# Altium project Dashboard.PrjPCB
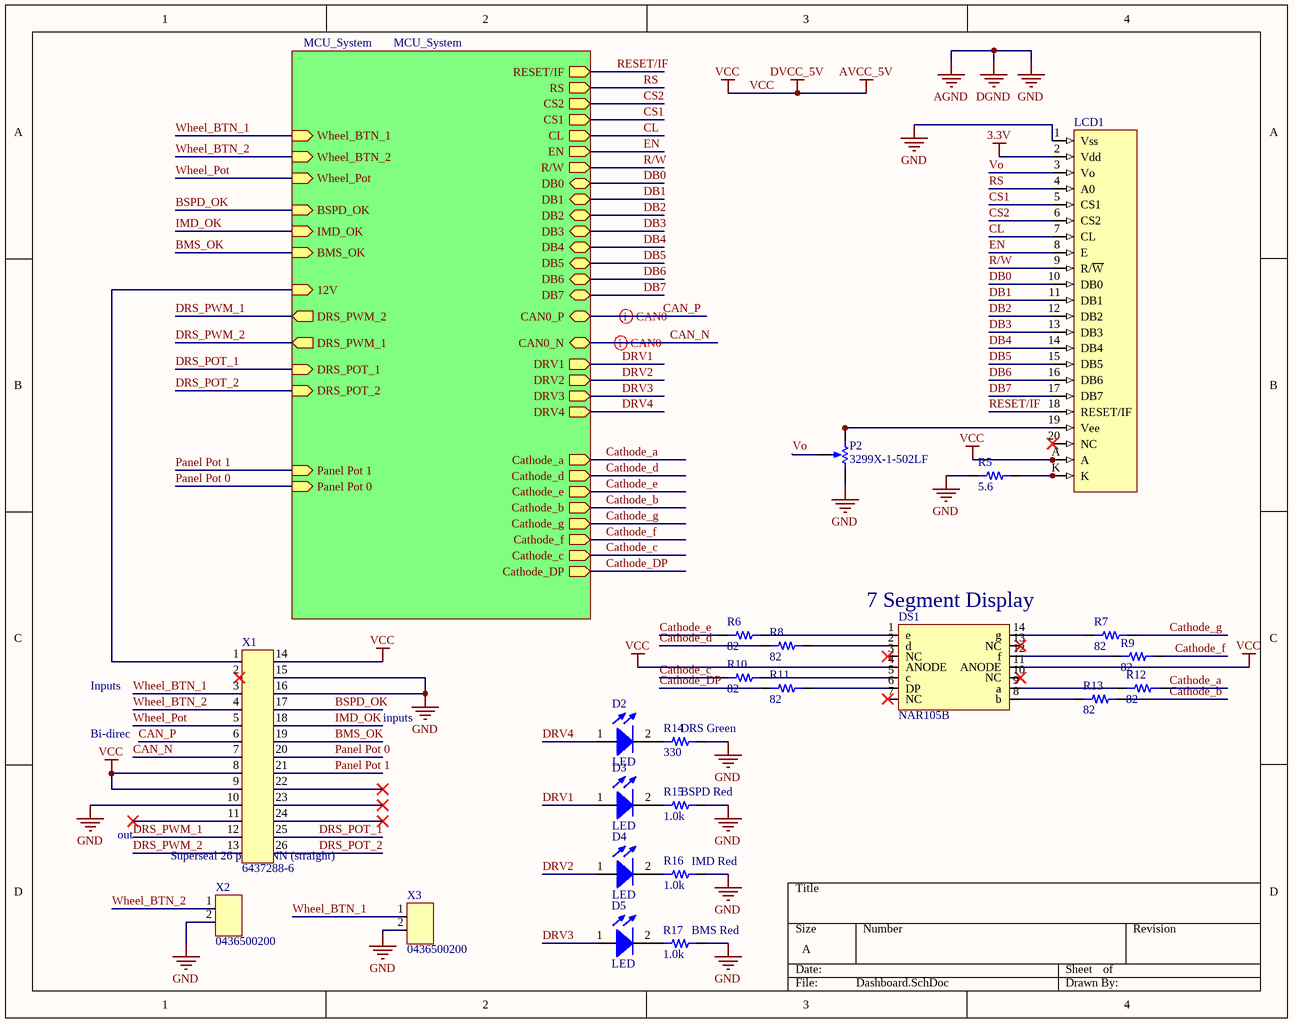
[diagram p0: Dashboard.SchDoc]
5 sheets, 60 parts. Net scope: hierarchical (ports join the sheet entries above them; power ports are global).
Board file: Dashboard.PcbDoc
Sheets:
  Dashboard.SchDoc
    MCU_System = MCU_System.SchDoc
      U_Power = Power.SchDoc
      U_High Side Drivers = High Side Drivers.SchDoc
      U_DRS_POT_LPFs = DRS_POT_LPFs.SchDoc

## Sheet Dashboard.SchDoc
size A

### Parts
D2  LED  [LED TH]
D3  LED  [LED TH]
D4  LED  [LED TH]
D5  LED  [LED TH]
DS1  NAR105B  [Stanley7Seg]
LCD1  (no value)  [NHD-12232]
P2  3299X-1-502LF  [3299X-1-502LF]
R5  value 5.6  [RES 0805/2012]  (hidden comment: Resistor 5.6 0805 1/2W 1%)
R6  value 82  [RES 0805/2012]  (hidden comment: Resistor 82 0805 1/4W 5%)
R7  value 82  [RES 0805/2012]  (hidden comment: Resistor 82 0805 1/4W 5%)
R8  value 82  [RES 0805/2012]  (hidden comment: Resistor 82 0805 1/4W 5%)
R9  value 82  [RES 0805/2012]  (hidden comment: Resistor 82 0805 1/4W 5%)
R10  value 82  [RES 0805/2012]  (hidden comment: Resistor 82 0805 1/4W 5%)
R11  value 82  [RES 0805/2012]  (hidden comment: Resistor 82 0805 1/4W 5%)
R12  value 82  [RES 0805/2012]  (hidden comment: Resistor 82 0805 1/4W 5%)
R13  value 82  [RES 0805/2012]  (hidden comment: Resistor 82 0805 1/4W 5%)
R14  value 330  [RES 0805/2012]  (hidden comment: Resistor 330 0805 1/4W 5%)
R15  value 1.0k  [RES 0805/2012]  (hidden comment: Resistor 1.0k 0805 1/4W 5%)
R16  value 1.0k  [RES 0805/2012]  (hidden comment: Resistor 1.0k 0805 1/4W 5%)
R17  value 1.0k  [RES 0805/2012]  (hidden comment: Resistor 1.0k 0805 1/4W 5%)
X1  6437288-6  [TE_Amp_6437288-6]
X2  0436500200  [CONN 43650-0200 MOLEX 2PIN]
X3  0436500200  [CONN 43650-0200 MOLEX 2PIN]

### Sub-sheets
MCU_System = MCU_System: Wheel_BTN_2 (in), Wheel_BTN_1 (in), Wheel_Pot (in), CAN0_N (bidir), CAN0_P (bidir), 12V (in), DRS_PWM_2 (out), DRS_PWM_1 (out), BMS_OK (in), IMD_OK (in), BSPD_OK (in), EN (out), R/W (out), CS2 (out), CS1 (out), RS (out), RESET/IF (out), CL (out), DRV2 (out), DRV3 (out), DRV1 (out), DRS_POT_1 (in), DRS_POT_2 (in), DB7 (bidir), DB3 (bidir), DB4 (bidir), DB5 (bidir), DB6 (bidir), DB1 (bidir), DB2 (bidir), DB0 (bidir), DRV4 (out), Cathode_a (out), Cathode_d (out), Cathode_e (out), Cathode_b (out), Cathode_g (out), Cathode_f (out), Cathode_c (out), Cathode_DP (out), Panel Pot 1 (in), Panel Pot 0 (in)

### Nets
3.3V: LCD1.2(Vdd)
AGND: LCD1.1(Vss) P2.3(BOT) R5.1 R14.2 R15.2 R16.2 R17.2 X1.10 X1.15 X1.16 X2.2 X3.2  [also labelled DGND, GND]
VCC: DS1.4(ANODE) DS1.11(ANODE) LCD1.A LCD1.A2(A) X1.8 X1.9 X1.14  [also labelled AVCC_5V, DVCC_5V]
BMS_OK: X1.19 ; sheet MCU_System/BMS_OK
BSPD_OK: X1.17 ; sheet MCU_System/BSPD_OK
CAN_N: X1.7 ; sheet MCU_System/CAN0_N
CAN_P: X1.6 ; sheet MCU_System/CAN0_P
Cathode_a: R12.2 ; sheet MCU_System/Cathode_a
Cathode_b: R13.2 ; sheet MCU_System/Cathode_b
Cathode_c: R10.1 ; sheet MCU_System/Cathode_c
Cathode_d: R8.1 ; sheet MCU_System/Cathode_d
Cathode_DP: R11.1 ; sheet MCU_System/Cathode_DP
Cathode_e: R6.1 ; sheet MCU_System/Cathode_e
Cathode_f: R9.2 ; sheet MCU_System/Cathode_f
Cathode_g: R7.2 ; sheet MCU_System/Cathode_g
CL: LCD1.7(CL) ; sheet MCU_System/CL
CS1: LCD1.5(CS1) ; sheet MCU_System/CS1
CS2: LCD1.6(CS2) ; sheet MCU_System/CS2
DB0: LCD1.10(DB0) ; sheet MCU_System/DB0
DB1: LCD1.11(DB1) ; sheet MCU_System/DB1
DB2: LCD1.12(DB2) ; sheet MCU_System/DB2
DB3: LCD1.13(DB3) ; sheet MCU_System/DB3
DB4: LCD1.14(DB4) ; sheet MCU_System/DB4
DB5: LCD1.15(DB5) ; sheet MCU_System/DB5
DB6: LCD1.16(DB6) ; sheet MCU_System/DB6
DB7: LCD1.17(DB7) ; sheet MCU_System/DB7
DRS_POT_1: X1.25 ; sheet MCU_System/DRS_POT_1
DRS_POT_2: X1.26 ; sheet MCU_System/DRS_POT_2
DRS_PWM_1: X1.12 ; sheet MCU_System/DRS_PWM_2
DRS_PWM_2: X1.13 ; sheet MCU_System/DRS_PWM_1
DRV1: D3.1(A) ; sheet MCU_System/DRV1
DRV2: D4.1(A) ; sheet MCU_System/DRV2
DRV3: D5.1(A) ; sheet MCU_System/DRV3
DRV4: D2.1(A) ; sheet MCU_System/DRV4
EN: LCD1.8(E) ; sheet MCU_System/EN
IMD_OK: X1.18 ; sheet MCU_System/IMD_OK
Panel Pot 0: X1.20 ; sheet MCU_System/Panel Pot 0
Panel Pot 1: X1.21 ; sheet MCU_System/Panel Pot 1
R/W: LCD1.9(R/~{W}) ; sheet MCU_System/R/W
RESET/IF: LCD1.18(RESET/IF) ; sheet MCU_System/RESET/IF
RS: LCD1.4(A0) ; sheet MCU_System/RS
Vo: LCD1.3(Vo) P2.2(TAP)
Wheel_BTN_1: X1.3 X3.1 ; sheet MCU_System/Wheel_BTN_1
Wheel_BTN_2: X1.4 X2.1 ; sheet MCU_System/Wheel_BTN_2
Wheel_Pot: X1.5 ; sheet MCU_System/Wheel_Pot
NetD2_2: D2.2(K) R14.1
NetD3_2: D3.2(K) R15.1
NetD4_2: D4.2(K) R16.1
NetD5_2: D5.2(K) R17.1
NetDS1_1: DS1.1(e) R6.2
NetDS1_2: DS1.2(d) R8.2
NetDS1_5: DS1.5(c) R10.2
NetDS1_6: DS1.6(DP) R11.2
NetDS1_8: DS1.8(b) R13.1
NetDS1_9: DS1.9(a) R12.1
NetDS1_12: DS1.12(f) R9.1
NetDS1_14: DS1.14(g) R7.1
NetLCD1_19: LCD1.19(Vee) P2.1(TOP)
NetLCD1_K: LCD1.K LCD1.K2(K) R5.2
NetX1_1: X1.1 ; sheet MCU_System/12V

Not connected (* = marked no-connect by the designer): DS1 3(NC)* 7(NC)* 10(NC)* 13(NC)*; LCD1 20(NC)*; X1 2* 11* 22* 23* 24*

### Layout directives
differential pair; rule Matched Net Lengths [Tolerance = 25.4mm]: CAN_N, CAN_P

### Notes on the sheet
- (near DS1) 7 Segment Display
- Inputs
- Bi-direc
- inputs
- (near R14) DRS Green
- out
- (near R15) BSPD Red
- (near X1) Superseal 26 pin CONN (straight)
- (near R16) IMD Red
- (near R17) BMS Red

### Library data of the parts
D2 = 4: LED GREEN DIFFUSED T/H; Manufacturer_id: 1; MfrPartNo: LTL-10233W; idLED: 4; Name: LED_TH_GREEN; Vf: 2.1V; Drawer_id: 1; Value: Green; Package: TH; Link: https://www.digikey.com/products/en?mpart=LTL-10233W&v=160
D3-D5 = 3: LED RED DIFFUSED T/H; Manufacturer_id: 1; MfrPartNo: LTL2R3KRD-EM; idLED: 3; Name: LED_TH_RED; Brightness: 50mcd; Id: 2mA; Vf: 1.8V; Drawer_id: 1; Value: Red; Package: TH; Link: https://www.digikey.com/products/en?mpart=LTL2R3KRD-EM&v=160
DS1 = 21: Character LED Display Module Red 7-Segment 1 Character Common Anode 3.4V 20mA 1.299" H x 0.898" W x 0.354" D (33.00mm x 22.80mm x 9.00mm) 14-DIP; Manufacturer_id: 7; idIC_Misc: 21; Drawer_id: 1; Name: 7_Seg_Disp; Type: 7 Segment; Protocol: Multiplexed; Vin(Max): 3.3V; MfrPartNo: NAR105B; Num_Circuits: 1; Package: DIP; Link: https://www.digikey.com/product-detail/en/stanley-electric-co/NAR105B/404-1126-ND/428836
LCD1 = 22: MfrPartNo: NHD-12232WG-EYYH-V#A-ND; Manufacturer_id: 10; idIC_Misc: 22; Drawer_id: 1; Name: NHD-12232 Display; Value: LCD Display; Vin(Min): 2.7V; Vin(Max): 3.3V; ComponentLink1Description: Datasheet; ComponentLink1URL: http://www.newhavendisplay.com/specs/NHD-12232WG-EYYH-VA.pdf
P2 = 6: Manufacturer_id: 1; idTable: 6; Value: 5K; Num_Contacts: 3; Pitch: 2.54mm; Drawer_id: 1; Name: 3299X-1-502LF; MfrPartNo: 3299X-1-502LF; Link: https://www.digikey.com/product-detail/en/bourns-inc/3299X-1-502LF/3299X-502LF-ND/1088167; ComponentLink1Description: Datasheet
R5 = 883: Manufacturer_id: 1; idResistor: 883; Name: Res_5.6_0805_1/2W_1%; Created_By: Nick Mah; Supplier 1: Digi-Key; Drawer_id: 1; Tolerance: 1%; Power: 1/2W; Package: 0805; ComponentLink1Description: Datasheet; Created_Date: 2018-10-20
R6-R13 = 1775: Manufacturer_id: 1; idResistor: 1775; Name: Res_82_0805_1/4W_5%; Created_By: Nick Mah; Supplier 1: Digi-Key; Drawer_id: 1; Tolerance: 5%; Power: 1/4W; Package: 0805; ComponentLink1Description: Datasheet; Created_Date: 2018-10-20
R14 = 1789: Manufacturer_id: 1; idResistor: 1789; Name: Res_330_0805_1/4W_5%; Created_By: Nick Mah; Supplier 1: Digi-Key; Drawer_id: 1; Tolerance: 5%; Power: 1/4W; Package: 0805; ComponentLink1Description: Datasheet; Created_Date: 2018-10-20
R15-R17 = 1801: Manufacturer_id: 1; idResistor: 1801; Name: Res_1.0k_0805_1/4W_5%; Created_By: Nick Mah; Supplier 1: Digi-Key; Drawer_id: 1; Tolerance: 5%; Power: 1/4W; Package: 0805; ComponentLink1Description: Datasheet; Created_Date: 2018-10-20
X1 = 7: Straight Angle 26Pos AMPSeal; Manufacturer_id: 5; idConn: 7; Drawer_id: 1; Name: AMP SuperSeal Straight; Value: CONN; Voltage_Rating: 250V; Num_Contacts: 26; Num_Rows: 4; Pitch: 3mm; Created_By: Nick; MfrPartNo: 6437288-6; Link: https://www.digikey.com/product-detail/en/te-connectivity-amp-connectors/6437288-6/A123256-ND/2329274; ComponentLink1Description: Drawing; ComponentLink1URL: https://www.te.com/commerce/DocumentDelivery/DDEController?Action=srchrtrv&DocNm=1437288-6&DocType=Customer+Drawing&DocLang=JP; Supplier1: Digi-Key; Supplier1PartNo: A123256-ND
X2 X3 = 9: Manufacturer_id: 4; idConn: 9; Drawer_id: 1; Name: Molex 43650_0200; Value: CONN; Num_Contacts: 2; Pitch: 3 mm; Created_By: Nick; MfrPartNo: 0436500200; Num_Rows: 1; Link: https://www.digikey.com/product-detail/en/molex-llc/0436500200/WM1860-ND/268989; ComponentLink1Description: Datasheet; ComponentLink1URL: https://www.molex.com/pdm_docs/sd/436500200_sd.pdf; Supplier1: Digi-Key; Supplier1PartNo: WM1860-ND

## Sheet MCU_System.SchDoc
size A
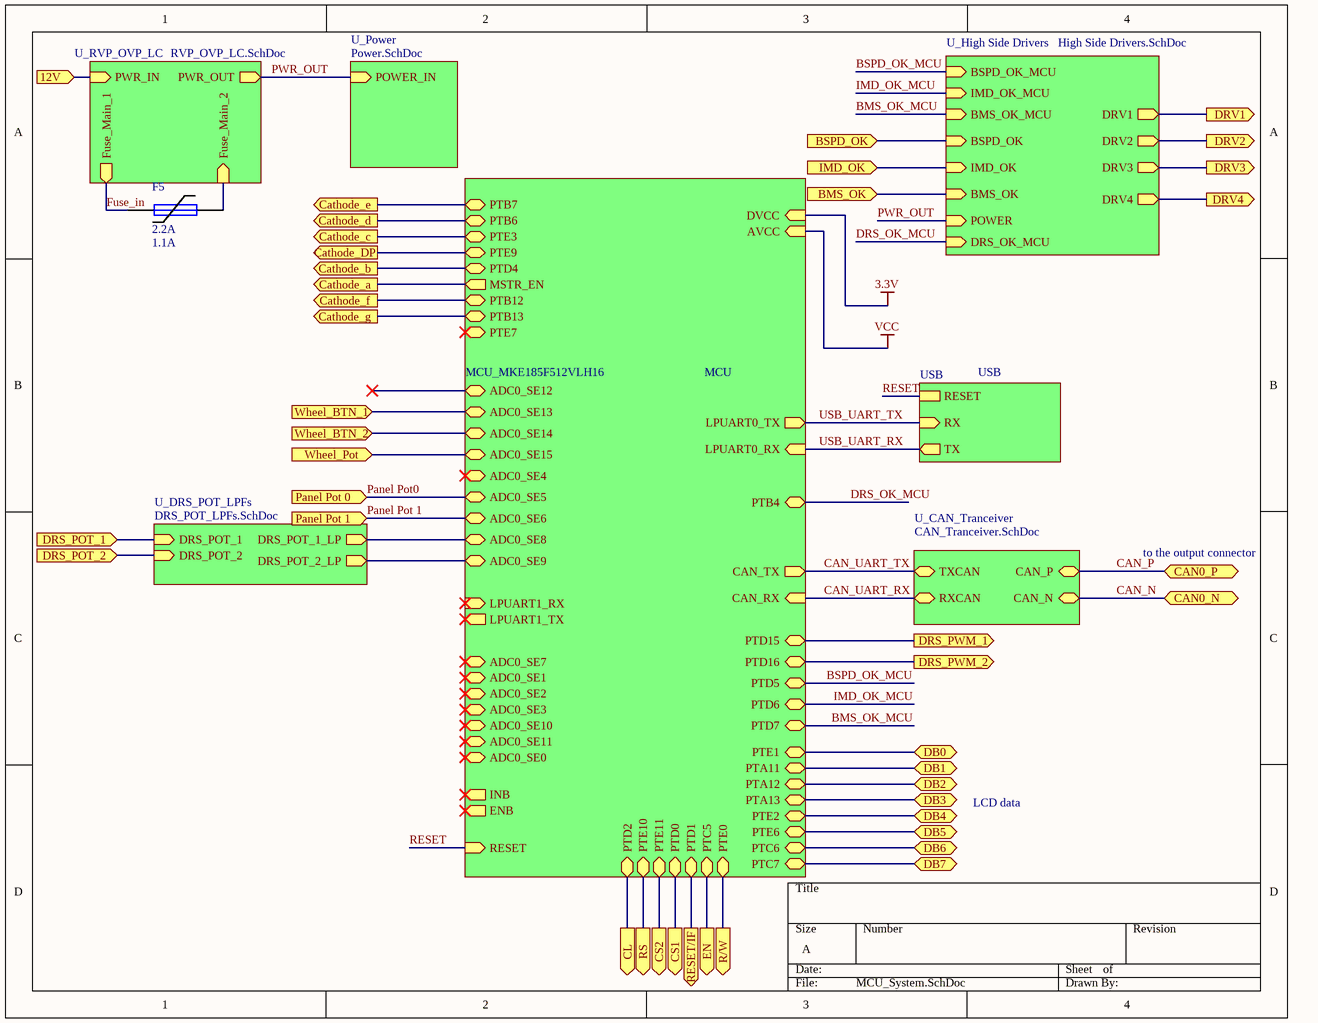
[diagram p1: MCU_System.SchDoc]

### Parts
F5  2.2A  I_hold: 1.1A  [PTC Fuse 1206/3216]

### Sub-sheets
MCU = MCU_MKE185F512VLH16 (file not in this document): LPUART1_RX (in), LPUART0_TX (out), LPUART0_RX (in), RESET (in), PTD6 (bidir), PTD7 (bidir), PTD5 (bidir), PTD15 (bidir), PTD16 (bidir), INB (out), ADC0_SE6 (bidir), ADC0_SE7 (bidir), ADC0_SE8 (bidir), ADC0_SE1 (bidir), ADC0_SE13 (bidir), ADC0_SE14 (bidir), ADC0_SE10 (bidir), ADC0_SE11 (bidir), ENB (out), ADC0_SE0 (bidir), ADC0_SE9 (bidir), ADC0_SE12 (bidir), ADC0_SE15 (bidir), PTB4 (bidir), AVCC (in), DVCC (in), ADC0_SE5 (bidir), MSTR_EN (out), ADC0_SE2 (bidir), ADC0_SE3 (bidir), ADC0_SE4 (bidir), PTE11 (bidir), PTE10 (bidir), PTB7 (bidir), PTB6 (bidir), PTE3 (bidir), PTE9 (bidir), PTE6 (bidir), PTC6 (bidir), PTC7 (bidir), PTD1 (bidir), PTD0 (bidir), PTA11 (bidir), PTA12 (bidir), PTA13 (bidir), PTD2 (bidir), PTE0 (bidir), PTE1 (bidir), PTE2 (bidir), PTB12 (bidir), PTB13 (bidir), PTD4 (bidir), PTC5 (bidir), PTE7 (bidir), LPUART1_TX (out), CAN_RX (in), CAN_TX (out)
U_CAN_Tranceiver = CAN_Tranceiver.SchDoc (file not in this document): TXCAN (bidir), RXCAN (bidir), CAN_N (bidir), CAN_P (bidir)
U_DRS_POT_LPFs = DRS_POT_LPFs.SchDoc: DRS_POT_1_LP (out), DRS_POT_1 (in), DRS_POT_2_LP (out), DRS_POT_2 (in)
U_High Side Drivers = High Side Drivers.SchDoc: BSPD_OK (in), IMD_OK (in), BMS_OK (in), DRV2 (out), DRV1 (out), DRV3 (out), BMS_OK_MCU (in), BSPD_OK_MCU (in), IMD_OK_MCU (in), POWER (in), DRS_OK_MCU (in), DRV4 (out)
U_Power = Power.SchDoc: POWER_IN (in)
U_RVP_OVP_LC = RVP_OVP_LC.SchDoc (file not in this document): PWR_IN (in), PWR_OUT (out), Fuse_Main_2 (in), Fuse_Main_1 (out)
USB = USB (file not in this document): TX (out), RX (in), RESET

### Ports
12V (in), BMS_OK (in), BSPD_OK (in), CAN0_N (bidir), CAN0_P (bidir), Cathode_a (out), Cathode_b (out), Cathode_c (out), Cathode_d (out), Cathode_DP (out), Cathode_e (out), Cathode_f (out), Cathode_g (out), CL (out), CS1 (out), CS2 (out), DB0 (bidir), DB1 (bidir), DB2 (bidir), DB3 (bidir), DB4 (bidir), DB5 (bidir), DB6 (bidir), DB7 (bidir), DRS_POT_1 (in), DRS_POT_2 (in), DRS_PWM_1 (out), DRS_PWM_2 (out), DRV1 (out), DRV2 (out), DRV3 (out), DRV4 (out), EN (out), IMD_OK (in), Panel Pot 0 (in), Panel Pot 1 (in), R/W (out), RESET/IF (out), RS (out), Wheel_BTN_1 (in), Wheel_BTN_2 (in), Wheel_Pot (in)

### Nets
BMS_OK: port BMS_OK, sheet U_High Side Drivers/BMS_OK
BMS_OK_MCU: sheet MCU/PTD7, sheet U_High Side Drivers/BMS_OK_MCU
BSPD_OK: port BSPD_OK, sheet U_High Side Drivers/BSPD_OK
BSPD_OK_MCU: sheet MCU/PTD5, sheet U_High Side Drivers/BSPD_OK_MCU
CAN_N: port CAN0_N, sheet U_CAN_Tranceiver/CAN_N
CAN_P: port CAN0_P, sheet U_CAN_Tranceiver/CAN_P
CAN_UART_RX: sheet MCU/CAN_RX, sheet U_CAN_Tranceiver/RXCAN
CAN_UART_TX: sheet MCU/CAN_TX, sheet U_CAN_Tranceiver/TXCAN
Cathode_a: port Cathode_a, sheet MCU/MSTR_EN
Cathode_b: port Cathode_b, sheet MCU/PTD4
Cathode_c: port Cathode_c, sheet MCU/PTE3
Cathode_d: port Cathode_d, sheet MCU/PTB6
Cathode_DP: port Cathode_DP, sheet MCU/PTE9
Cathode_e: port Cathode_e, sheet MCU/PTB7
Cathode_f: port Cathode_f, sheet MCU/PTB12
Cathode_g: port Cathode_g, sheet MCU/PTB13
CL: port CL, sheet MCU/PTD2
CS1: port CS1, sheet MCU/PTD0
CS2: port CS2, sheet MCU/PTE11
DB0: port DB0, sheet MCU/PTE1
DB1: port DB1, sheet MCU/PTA11
DB2: port DB2, sheet MCU/PTA12
DB3: port DB3, sheet MCU/PTA13
DB4: port DB4, sheet MCU/PTE2
DB5: port DB5, sheet MCU/PTE6
DB6: port DB6, sheet MCU/PTC6
DB7: port DB7, sheet MCU/PTC7
DRS_OK_MCU: sheet MCU/PTB4, sheet U_High Side Drivers/DRS_OK_MCU
DRS_POT_1: port DRS_POT_1, sheet U_DRS_POT_LPFs/DRS_POT_1
DRS_POT_2: port DRS_POT_2, sheet U_DRS_POT_LPFs/DRS_POT_2
DRS_PWM_1: port DRS_PWM_2, sheet MCU/PTD16
DRS_PWM_2: port DRS_PWM_1, sheet MCU/PTD15
DRV1: port DRV1, sheet U_High Side Drivers/DRV1
DRV2: port DRV2, sheet U_High Side Drivers/DRV2
DRV3: port DRV3, sheet U_High Side Drivers/DRV3
DRV4: port DRV4, sheet U_High Side Drivers/DRV4
EN: port EN, sheet MCU/PTC5
Fuse_in: F5.1 ; sheet U_RVP_OVP_LC/Fuse_Main_1
IMD_OK: port IMD_OK, sheet U_High Side Drivers/IMD_OK
IMD_OK_MCU: sheet MCU/PTD6, sheet U_High Side Drivers/IMD_OK_MCU
Panel Pot0: port Panel Pot 0, sheet MCU/ADC0_SE5  [project net Panel Pot 0]
Panel Pot 1: port Panel Pot 1, sheet MCU/ADC0_SE6
PWR_OUT: sheet U_RVP_OVP_LC/PWR_OUT, sheet U_Power/POWER_IN, sheet U_High Side Drivers/POWER  [project net 12V]
R/W: port R/W, sheet MCU/PTE0
RESET: sheet MCU/RESET, sheet USB/RESET
RESET/IF: port RESET/IF, sheet MCU/PTD1
RS: port RS, sheet MCU/PTE10
USB_UART_RX: sheet MCU/LPUART0_RX, sheet USB/TX
USB_UART_TX: sheet MCU/LPUART0_TX, sheet USB/RX
Wheel_BTN_1: port Wheel_BTN_1, sheet MCU/ADC0_SE13
Wheel_BTN_2: port Wheel_BTN_2, sheet MCU/ADC0_SE14
Wheel_Pot: port Wheel_Pot, sheet MCU/ADC0_SE15
NetC14_2: sheet MCU/ADC0_SE8, sheet U_DRS_POT_LPFs/DRS_POT_1_LP
NetC15_2: sheet MCU/ADC0_SE9, sheet U_DRS_POT_LPFs/DRS_POT_2_LP
NetF5_2: F5.2 ; sheet U_RVP_OVP_LC/Fuse_Main_2
NetX1_1: port 12V, sheet U_RVP_OVP_LC/PWR_IN

### Notes on the sheet
- to the output connector
- LCD data

### Library data of the parts
F5 = 8: Fuse; Manufacturer_id: 1; MfrPartNo: 1206L110/12SLYR; idFuse: 8; Name: Resettable; I_max: 50A; V_max: 12V; Pd_Typ: .8W; Published: 8-Jun-2000; LatestRevisionDate: 17-Jul-2002; LatestRevisionNote: Re-released for DXP Platform.; PackageReference: PIN-W2/E2.8; Publisher: Altium Limited; PackageDescription: Thru-Hole; 2 Leads; Drawer_id: 1; I_trip: 2.2A; Link: https://www.digikey.com/product-detail/en/littelfuse-inc/1206L110-12SLYR/F5764CT-ND/3593809

## Sheet Power.SchDoc
size A
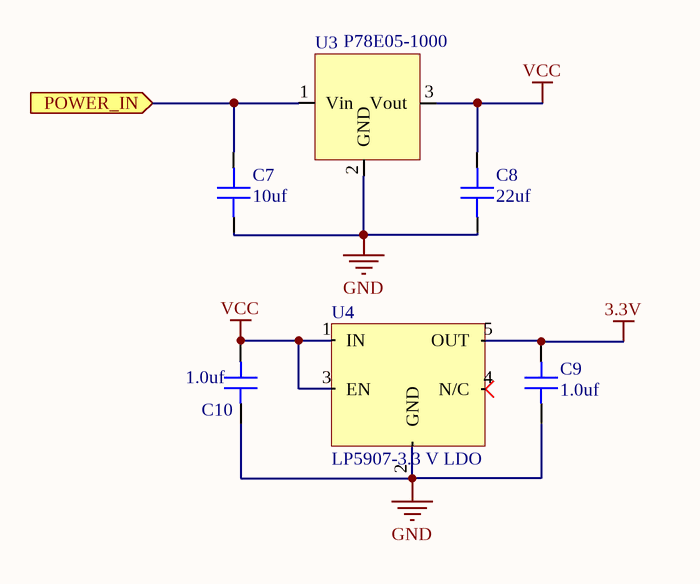
[diagram p2: Power.SchDoc]

### Parts
C7  value 10uf  [CAP 1206/3216 - 1.8MM]  (hidden comment: Capacitor MLCC 1.1pf 50V CAP 1206/3216)
C8  value 22uf  [CAP 0805/2012]  (hidden comment: Capacitor MLCC 22uf 16V CAP 0805/2012)
C9  value 1.0uf  [CAP 0603/1608]  (hidden comment: Capacitor MLCC 1.0uf 16V CAP 0603/1608)
C10  value 1.0uf  [CAP 0603/1608]  (hidden comment: Capacitor MLCC 1.0uf 16V CAP 0603/1608)
U3  P78E05-1000  [P78E05]
U4  LP5907-3.3 V LDO  [SOT23-5]

### Ports
POWER_IN (in)

### Nets
3.3V: C9.2 U4.5(OUT)
GND: C7.1 C8.1 C9.1 C10.1 U3.2(GND) U4.2(GND)  [project net AGND]
VCC: C8.2 C10.2 U3.3(Vout) U4.1(IN) U4.3(EN)
12V: C7.2 U3.1(Vin) ; port POWER_IN

Not connected (* = marked no-connect by the designer): U4 4(N/C)*

### Library data of the parts
C7 = 1081: Manufacturer_id: 1; idCapacitor: 1081; Name: Cap_10uf_50V_CAP 1206-3216; Dielectric: Ceramic; ESR: Null; Created_By: Nick Mah; Drawer_id: 1; Voltage_Rating: 50V; Package: CAP 2106/3216; ComponentLink1Description: Datasheet
C8 = 357: Manufacturer_id: 1; idCapacitor: 357; Name: Cap_22uf_16V_CAP 0805/2012; Dielectric: Ceramic; Created_By: Nick Mah; Drawer_id: 1; Voltage_Rating: 16V; Package: CAP 0805/2012; Created_Date: 10/20/2018
C9 C10 = 229: Manufacturer_id: 1; idCapacitor: 229; Name: Cap_1.0uf_16V_CAP 0603/1608; Dielectric: Ceramic; Created_By: Nick Mah; Drawer_id: 1; Voltage_Rating: 16V; Package: CAP 0603/1608; Created_Date: 10/20/2018
U3 = 1: Non-Isolated PoL Module DC DC Converter 1 Output 5V    1A 8V - 36V Input; Manufacturer_id: 11; idPMIC_SW: 1; Name: P78E05 5V Regulator; Value: Buck; Discrete: No; Power: 5W; Vout_Type: Fixed; Fs: 520kHz; Created_By: Nick; MfrPartNo: P78E05-1000; Drawer_id: 1; Num_Outputs: 1; Topology: Buck; Vin(Min): 8V; Vin(Max): 36V; Vout(Min): 5V; Vout(Max): 5V; Current_Rating: 1A; Package: 3-SIP; Link: https://www.digikey.com/product-detail/en/cui-inc/P78E05-1000/102-5018-ND/9649654; ComponentLink1Description: Datasheet; ComponentLink1URL: https://www.cui.com/product/resource/p78e-1000.pdf; Supplier1: Digi-Key; Supplier1PartNo: 102-5018-ND
U4 = 4: Manufacturer_id: 1; MfrPartNo: LP5907; idPMIC_Lin: 4; Name: LP5907 LDO; Value: 5.5V; Vin(Max): 6V; Drawer_id: 1; Package: SOT23-5

## Sheet High Side Drivers.SchDoc
size A
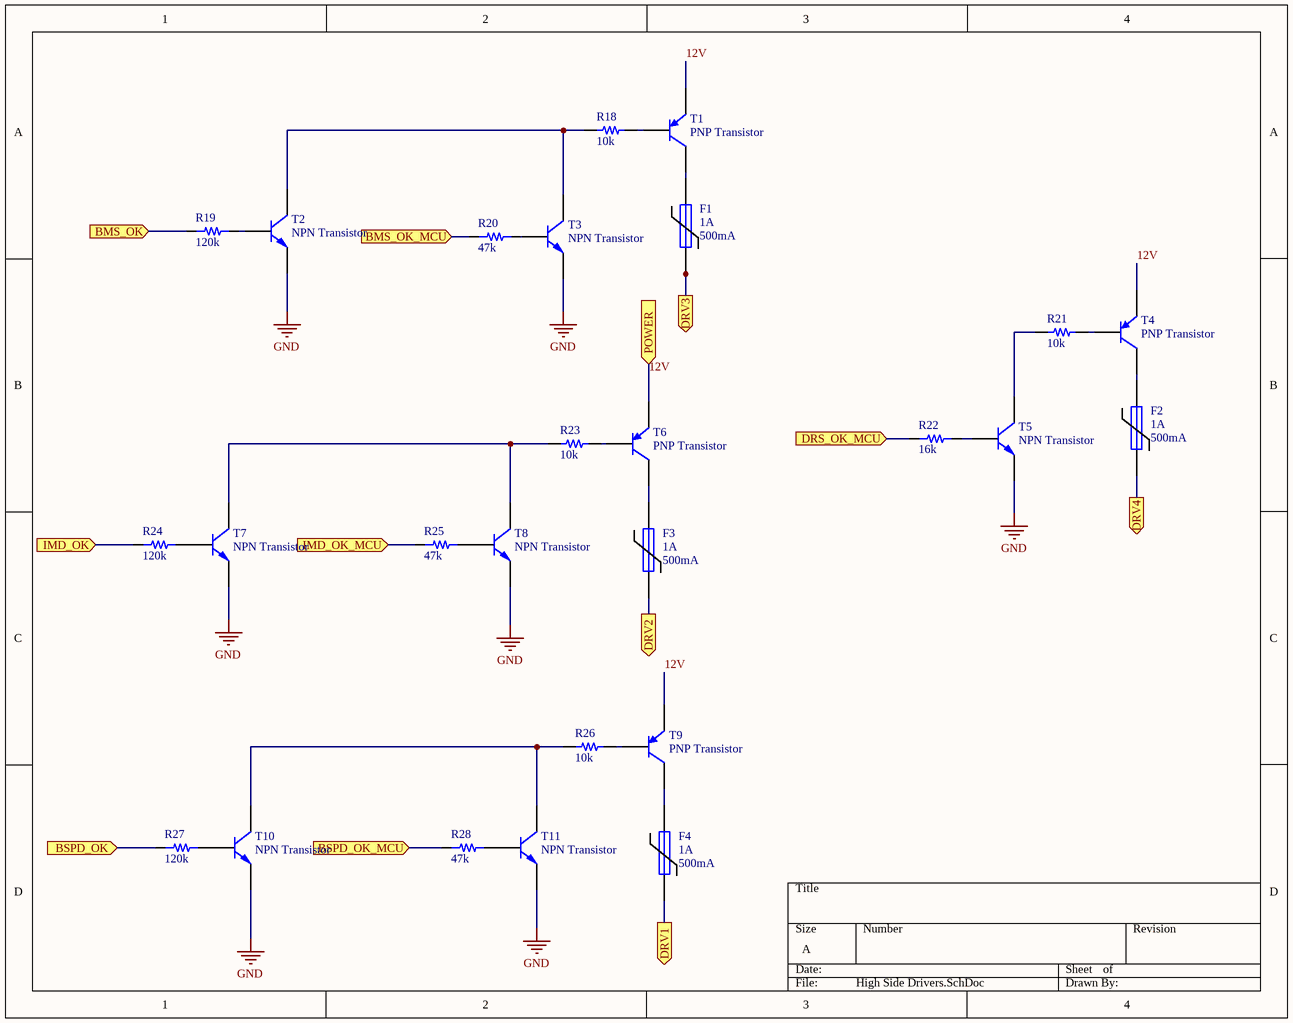
[diagram p3: High Side Drivers.SchDoc]

### Parts
F1  1A  I_hold: 500mA  [PTC Fuse 1206/3216]
F2  1A  I_hold: 500mA  [PTC Fuse 1206/3216]
F3  1A  I_hold: 500mA  [PTC Fuse 1206/3216]
F4  1A  I_hold: 500mA  [PTC Fuse 1206/3216]
R18  value 10k  [RES 0805/2012]  (hidden comment: Resistor 10k 0805 1/4W 5%)
R19  value 120k  [RES 0805/2012]  (hidden comment: Resistor 120k 0805 1/4W 1%)
R20  value 47k  [RES 0805/2012]  (hidden comment: Resistor 47k 0805 1/4W 1%)
R21  value 10k  [RES 0805/2012]  (hidden comment: Resistor 10k 0805 1/4W 5%)
R22  value 16k  [RES 0805/2012]  (hidden comment: Resistor 16k 0805 1/4W 1%)
R23  value 10k  [RES 0805/2012]  (hidden comment: Resistor 10k 0805 1/4W 5%)
R24  value 120k  [RES 0805/2012]  (hidden comment: Resistor 120k 0805 1/4W 1%)
R25  value 47k  [RES 0805/2012]  (hidden comment: Resistor 47k 0805 1/4W 1%)
R26  value 10k  [RES 0805/2012]  (hidden comment: Resistor 10k 0805 1/4W 5%)
R27  value 120k  [RES 0805/2012]  (hidden comment: Resistor 120k 0805 1/4W 1%)
R28  value 47k  [RES 0805/2012]  (hidden comment: Resistor 47k 0805 1/4W 1%)
T1  PNP Transistor  [SOT23-3]
T2  NPN Transistor  [SOT23-3]
T3  NPN Transistor  [SOT23-3]
T4  PNP Transistor  [SOT23-3]
T5  NPN Transistor  [SOT23-3]
T6  PNP Transistor  [SOT23-3]
T7  NPN Transistor  [SOT23-3]
T8  NPN Transistor  [SOT23-3]
T9  PNP Transistor  [SOT23-3]
T10  NPN Transistor  [SOT23-3]
T11  NPN Transistor  [SOT23-3]

### Ports
BMS_OK (in), BMS_OK_MCU (in), BSPD_OK (in), BSPD_OK_MCU (in), DRS_OK_MCU (in), DRV1 (out), DRV2 (out), DRV3 (out), DRV4 (out), IMD_OK (in), IMD_OK_MCU (in), POWER (in)

### Nets
GND: T2.1(E) T3.1(E) T5.1(E) T7.1(E) T8.1(E) T10.1(E) T11.1(E)  [project net AGND]
12V: T1.2(E) T4.2(E) T6.2(E) T9.2(E) ; port POWER
BMS_OK: R19.1 ; port BMS_OK
BMS_OK_MCU: R20.1 ; port BMS_OK_MCU
BSPD_OK: R27.1 ; port BSPD_OK
BSPD_OK_MCU: R28.1 ; port BSPD_OK_MCU
DRS_OK_MCU: R22.1 ; port DRS_OK_MCU
DRV1: F4.1 ; port DRV1
DRV2: F3.1 ; port DRV2
DRV3: F1.1 ; port DRV3
DRV4: F2.1 ; port DRV4
IMD_OK: R24.1 ; port IMD_OK
IMD_OK_MCU: R25.1 ; port IMD_OK_MCU
NetF1_2: F1.2 T1.3(C)
NetF2_2: F2.2 T4.3(C)
NetF3_2: F3.2 T6.3(C)
NetF4_2: F4.2 T9.3(C)
NetR18_1: R18.1 T2.3(C) T3.3(C)
NetR18_2: R18.2 T1.1(B)
NetR19_2: R19.2 T2.2(B)
NetR20_2: R20.2 T3.2(B)
NetR21_1: R21.1 T5.3(C)
NetR21_2: R21.2 T4.1(B)
NetR22_2: R22.2 T5.2(B)
NetR23_1: R23.1 T7.3(C) T8.3(C)
NetR23_2: R23.2 T6.1(B)
NetR24_2: R24.2 T7.2(B)
NetR25_2: R25.2 T8.2(B)
NetR26_1: R26.1 T10.3(C) T11.3(C)
NetR26_2: R26.2 T9.1(B)
NetR27_2: R27.2 T10.2(B)
NetR28_2: R28.2 T11.2(B)

### Library data of the parts
F1-F4 = 5: Fuse; Manufacturer_id: 1; MfrPartNo: 1206L050/15YR; idFuse: 5; Name: PTC Poly Fuse Resettable; I_max: 100A; V_max: 15V; Pd_Typ: 600mW; Created_By: Angel; Published: 8-Jun-2000; LatestRevisionDate: 17-Jul-2002; LatestRevisionNote: Re-released for DXP Platform.; PackageReference: PIN-W2/E2.8; Publisher: Altium Limited; PackageDescription: Thru-Hole; 2 Leads; Drawer_id: 1; I_trip: 1A; Link: https://www.digikey.com/product-detail/en/littelfuse-inc/1206L050-15YR/F3733CT-ND/2486168; Created_Date: 10/27/2018
R18 R21 R23 R26 = 1825: Manufacturer_id: 1; idResistor: 1825; Name: Res_10k_0805_1/4W_5%; Created_By: Nick Mah; Supplier 1: Digi-Key; Drawer_id: 1; Tolerance: 5%; Power: 1/4W; Package: 0805; ComponentLink1Description: Datasheet; Created_Date: 2018-10-20
R19 R24 R27 = 771: Manufacturer_id: 1; idResistor: 771; Name: Res_120k_0805_1/4W_1%; Created_By: Nick Mah; Supplier 1: Digi-Key; Drawer_id: 1; Tolerance: 1%; Power: 1/4W; Package: 0805; ComponentLink1Description: Datasheet; Created_Date: 2018-10-20
R20 R25 R28 = 761: Manufacturer_id: 1; idResistor: 761; Name: Res_47k_0805_1/4W_1%; Created_By: Nick Mah; Supplier 1: Digi-Key; Drawer_id: 1; Tolerance: 1%; Power: 1/4W; Package: 0805; ComponentLink1Description: Datasheet; Created_Date: 2018-10-20
R22 = 750: Manufacturer_id: 1; idResistor: 750; Name: Res_16k_0805_1/4W_1%; Created_By: Nick Mah; Supplier 1: Digi-Key; Drawer_id: 1; Tolerance: 1%; Power: 1/4W; Package: 0805; ComponentLink1Description: Datasheet; Created_Date: 2018-10-20
T1 T4 T6 T9 = 3: Manufacturer_id: 1; idBJT: 3; Name: MMBT4403WT1G; Ic: 600mA; Vce(Max): -40V; Created_By: Angel; Drawer_id: 1; Type: PNP; Num_Circuits: 1; Package: SOT23-3; MfrPartNo: MMBT4403WT1G; Link: https://www.digikey.com/product-detail/en/on-semiconductor/MMBT4403WT1G/MMBT4403WT1GOSCT-ND/3487572
T2 T3 T5 T7 T8 T10 T11 = 2: Manufacturer_id: 1; idBJT: 2; Name: MMBT4401; Drawer_id: 1; Type: NPN

## Sheet DRS_POT_LPFs.SchDoc
size A
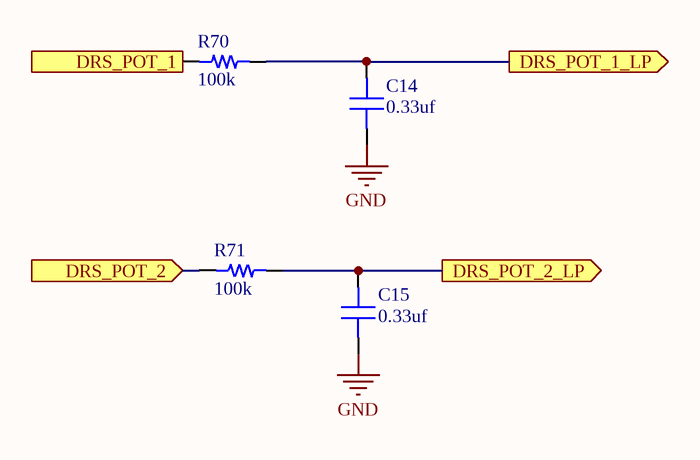
[diagram p4: DRS_POT_LPFs.SchDoc]

### Parts
C14  value 0.33uf  [CAP 0603/1608]  (hidden comment: Capacitor MLCC 0.33uf 16V CAP 0603/1608)
C15  value 0.33uf  [CAP 0603/1608]  (hidden comment: Capacitor MLCC 0.33uf 16V CAP 0603/1608)
R70  value 100k  [RES 0603/1608]  (hidden comment: Resistor 100k 0603 1/10W 1%)
R71  value 100k  [RES 0603/1608]  (hidden comment: Resistor 100k 0603 1/10W 1%)

### Ports
DRS_POT_1 (in), DRS_POT_1_LP (out), DRS_POT_2 (in), DRS_POT_2_LP (out)

### Nets
GND: C14.1 C15.1  [project net AGND]
DRS_POT_1: R70.1 ; port DRS_POT_1
DRS_POT_2: R71.1 ; port DRS_POT_2
NetC14_2: C14.2 R70.2 ; port DRS_POT_1_LP
NetC15_2: C15.2 R71.2 ; port DRS_POT_2_LP

### Library data of the parts
C14 C15 = 226: Manufacturer_id: 1; idCapacitor: 226; Name: Cap_0.33uf_16V_CAP 0603/1608; Dielectric: Ceramic; Created_By: Nick Mah; Drawer_id: 1; Voltage_Rating: 16V; Package: CAP 0603/1608; Created_Date: 10/20/2018
R70 R71 = 337: Manufacturer_id: 1; idResistor: 337; Name: Res_100k_0603_1/10W_1%; Created_By: Nick Mah; Supplier 1: Digi-Key; Drawer_id: 1; Tolerance: 1%; Power: 1/10W; Package: 0603; ComponentLink1Description: Datasheet; Created_Date: 2018-10-20

## Nets that join several sheets
3.3V: Dashboard (LCD1.2), Power (C9.2 U4.5)
AGND: Dashboard (12 pins), Power (6 pins), High Side Drivers (7 pins), DRS_POT_LPFs (C14.1 C15.1)
VCC: Dashboard (7 pins), Power (5 pins)
12V: Power (C7.2 U3.1), High Side Drivers (T1.2 T4.2 T6.2 T9.2)
BMS_OK: Dashboard (X1.19), High Side Drivers (R19.1)
BSPD_OK: Dashboard (X1.17), High Side Drivers (R27.1)
DRS_POT_1: Dashboard (X1.25), DRS_POT_LPFs (R70.1)
DRS_POT_2: Dashboard (X1.26), DRS_POT_LPFs (R71.1)
DRV1: Dashboard (D3.1), High Side Drivers (F4.1)
DRV2: Dashboard (D4.1), High Side Drivers (F3.1)
DRV3: Dashboard (D5.1), High Side Drivers (F1.1)
DRV4: Dashboard (D2.1), High Side Drivers (F2.1)
IMD_OK: Dashboard (X1.18), High Side Drivers (R24.1)